# Altium schematic sheet vtg regulator using TPS793.SchDoc
size A4; SheetNumber: 1; SheetTotal: 1
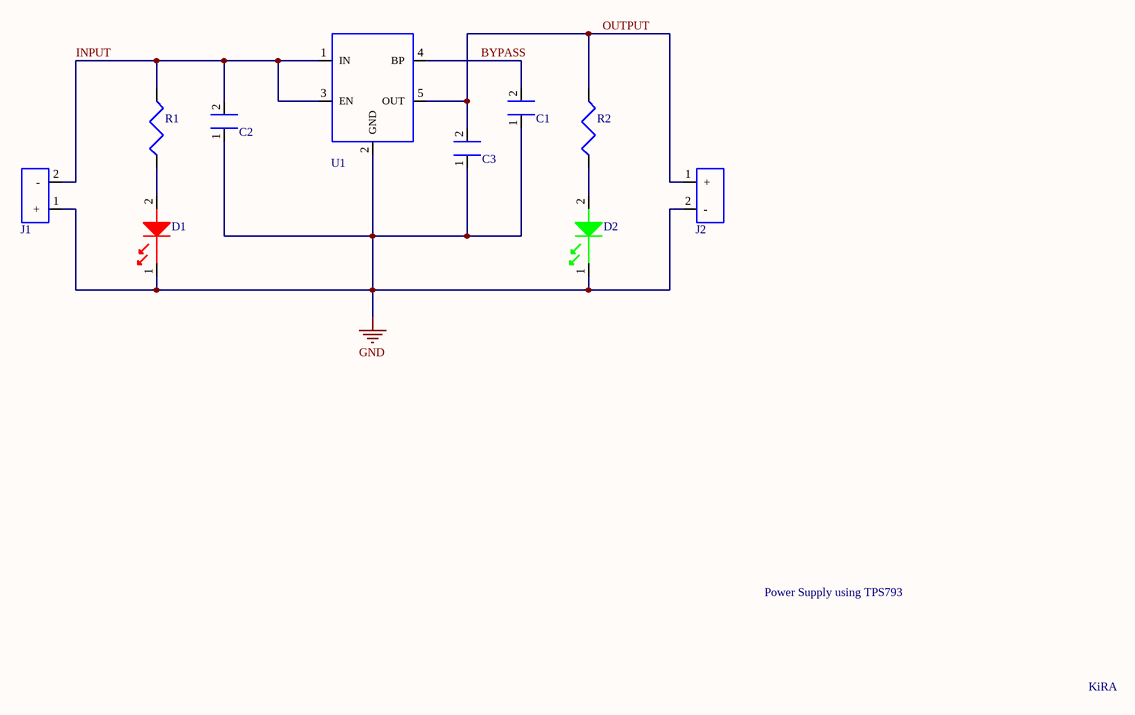
[diagram p0: vtg regulator using TPS793.SchDoc]

## Parts
C1  Capacitor 0805 0.01uF  [Capacitor 0805 0.01uF]  (value not drawn)
C2  Capacitor 0805 0.1uF  [Capacitor 0805 0.1uF]  (value not drawn)
C3  Capacitor 0805 2.2uF  [Capacitor 0805 2.2uF]  (value not drawn)
D1  LED 0805 Red  [LED 0805 Red]  (value not drawn)
D2  LED 0805 Green  [LED 0805 Green]  (value not drawn)
J1  Generic Header, 1X2 Vertical  [22232021]  (value not drawn)
J2  Generic Header, 1X2 Vertical  [22232021]  (value not drawn)
R1  Resistor 0805 291R  [Resistor 0805 291R]  (value not drawn)
R2  Resistor 0805 300R  [Resistor 0805 300R]  (value not drawn)
U1  TPS793  [TPS793]  (value not drawn)

## Nets
GND: C1.1 C2.1 C3.1 D1.1 D2.1 J1.1(+) J2.2(-) U1.2(GND)
BYPASS: C1.2 U1.4(BP)
INPUT: C2.2 J1.2(-) R1.2 U1.1(IN) U1.3(EN)
OUTPUT: C3.2 J2.1(+) R2.2 U1.5(OUT)
NetD1_2: D1.2 R1.1
NetD2_2: D2.2 R2.1

## Notes on the sheet
- Power Supply using TPS793
- KiRA

## Library data of the parts
C1 = Capacitor 0805 0.01uF: Manufacturer: Vishay; Part No: VJ0805Y103KXAAC; Voltage Rating: 50VDC; Dielectric: X7R; Capacitance: 0.01uF; Package: 0805; Product Type: Ceramic Capacitors
C2 = Capacitor 0805 0.1uF: Manufacturer: Vishay; Part No: VJ0805Y104KXAAT; Voltage Rating: 50VDC; Dielectric: X7R; Capacitance: 0.1uF; Package: 0805; Product Type: Ceramic Capacitor
C3 = Capacitor 0805 2.2uF: Manufacturer: Vishay; Part No: VJ0805V225MXQTW1BC; Voltage Rating: 10VDC; Dielectric: Y5V; Capacitance: 2.2uF; Product Type: Ceramic Capacitor; Package: 0805
D1 = LED 0805 Red: Manufacturer: Lite-On Inc; Part No: LTST-C171KRKT; Forward Voltage Vf: 2V; Current Test: 20mA; Colour: Red; Package: 0805
D2 = LED 0805 Green: Manufacturer: Lite-On Inc; Part No: LTST-C171GKT; Forward Voltage Vf: 2.1V; Test Current: 20mA; Pacakage: 0805; Colour: Green
J1 J2 = 22232021: Manufacturer: Molex; Series NO: 6373; Product Name: KK254; Current max per contact: 4A; Voltage max: 500V; Pitch: 2.54mm; Part No: 22232021; Product Category: PCB Headers and Receptacles; Component Type: PCB Header
R1 = Resistor 0805 291R: Manufacturer: KOA Speer Electronics Inc; Part No: (RN73R2ATTD2910B25); Serier: RN73R; Tolerance: 0.1%; Resistance: 291R; Package: 0805
R2 = Resistor 0805 300R: Manufacturer: YAGEO; Part No: RC0805JR-07300RL; Series: RC_L; Resistance: 300R; Package: 0805
U1 = Regulator TPS793: Manufacturer: Texas Instrument; Part No: TPS79333DBVRQ1; Output Configuration: Positive; Output Type: Fixed; Vtg Input: 5.5V; Vtg Output: 3.3V; Current Output: 200mA; Package: SOT-23-5